# Altium schematic sheet low_filter.SchDoc: KART : LOW FILTER
size A4; DrawnBy: JNieto; DocumentNumber: 4; Revision: 1.0; SheetNumber: 7; SheetTotal: 10; Version: V 1.0.0
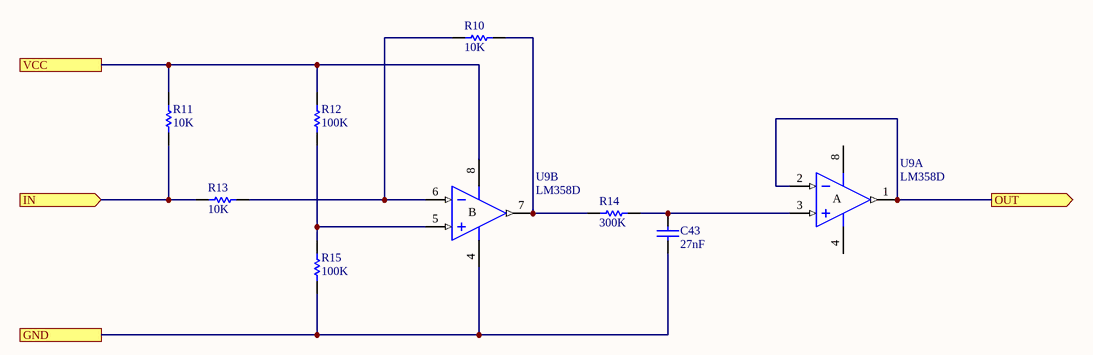
[diagram p0: low_filter.SchDoc]

## Parts
C43  value 27nF  [C0603]
R10  value 10K  [R0603]
R11  value 10K  [R0603]
R12  value 100K  [R0603]
R13  value 10K  [R0603]
R14  value 300K  [R0603]
R15  value 100K  [R0603]
U9  LM358D  [SO8_N]  (parts A,B of 2)

## Ports
GND, IN (in), OUT (out), VCC

## Nets
GND: C43.1 R15.2 U9.4(V-) ; port GND
IN: R11.2 R13.1 ; port IN
OUT: U9.1(OUT) U9.2(IN-) ; port OUT
VCC: R11.1 R12.1 U9.8(V+) ; port VCC
NetC43_2: C43.2 R14.2 U9.3(IN+)
NetR10_1: R10.1 R13.2 U9.6(IN-)
NetR10_2: R10.2 R14.1 U9.7(OUT)
NetR12_2: R12.2 R15.1 U9.5(IN+)

## Notes on the sheet
- (in symbol LM358D, part A) A
- (in symbol LM358D, part B) B

## Library data of the parts
C43 = MCD-00211: Capacitor, MLCC, 27nF, 16V, X7R, 10%, 0603, T=0,8mm; Manufacturer_Part_Number: CC0603KRX7R7BB104; Manufacturer: YAGEO; Provided_By: Subcon; Initial_Board_Reference: MB1319; Internal_Part_Number: MCD-00211; ECCN_US: n/a; ECCN_EU: n/a; ComponentLink1Description: Datasheet; Status: Released; Part_Type: Capacitor; Package: C0603; ComponentLink1URL: http://tunmcdsvn.tun.st.com/Component_Datasheet_Library/Trunk/Capacitors/Yageo_Multilayer_Capacitor_X7R_series_100pF_to_22uF
R10 R11 R13 = MCD-00220: Resistor,10K,0603,1%,1/10W; Manufacturer_Part_Number: RC0603FR-0710KL; Manufacturer: YAGEO; Provided_By: Subcon; Initial_Board_Reference: MB1319; Internal_Part_Number: MCD-00220; Status: Released; Part_Type: Resistor; ComponentLink1Description: Datasheet; ECCN_US: n/a; ECCN_EU: n/a; Package: R0603; ComponentLink1URL: http://tunmcdsvn.tun.st.com/Component_Datasheet_Library/Trunk/Resistors/Yageo_Resistor_RC0603-series
R12 R15 = MCD-00220: Resistor,100K,0603,1%,1/10W; Manufacturer_Part_Number: RC0603FR-0710KL; Manufacturer: YAGEO; Provided_By: Subcon; Initial_Board_Reference: MB1319; Internal_Part_Number: MCD-00220; Status: Released; Part_Type: Resistor; ComponentLink1Description: Datasheet; ECCN_US: n/a; ECCN_EU: n/a; Package: R0603; ComponentLink1URL: http://tunmcdsvn.tun.st.com/Component_Datasheet_Library/Trunk/Resistors/Yageo_Resistor_RC0603-series
R14 = MCD-00220: Resistor,300K,0603,1%,1/10W; Manufacturer_Part_Number: RC0603FR-0710KL; Manufacturer: YAGEO; Provided_By: Subcon; Initial_Board_Reference: MB1319; Internal_Part_Number: MCD-00220; Status: Released; Part_Type: Resistor; ComponentLink1Description: Datasheet; ECCN_US: n/a; ECCN_EU: n/a; Package: R0603; ComponentLink1URL: http://tunmcdsvn.tun.st.com/Component_Datasheet_Library/Trunk/Resistors/Yageo_Resistor_RC0603-series
U9 = LM358D: Dual Low-Power Operational Amplifier; Published: 24-Aug-2001; LatestRevisionDate: 13-Apr-2006; LatestRevisionNote: IPC-7351 Footprint Added.; PackageVersion: Dec-2002; PackageReference: SO8; Publisher: Altium Limited; PackageDescription: 8-Pin Small Outline Integrated Circuit 1.27 mm Pitch; Code_JEDEC: MS-012-AA; Code_IPC: SOIC127P600-8; ComponentLink1Description: Manufacturer Link; ComponentLink1URL: http://www.st.com/; ComponentLink2Description: Datasheet; ComponentLink2URL: http://www.st.com/stonline/products/literature/ds/2163/lm358.pdf